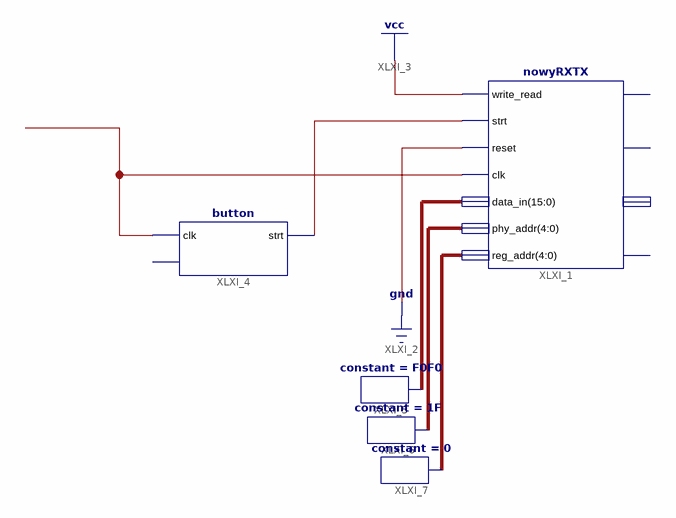
[diagram p0: schematic sheet 1]
// Xilinx ISE schematic nowy_sch.sch (spartan3e) as structural Verilog: 5 symbols, 0 ports
module nowy_sch (
);

  wire XLXN_2, XLXN_4;
  wire [4:0] XLXN_6, XLXN_7;
  wire [15:0] XLXN_5;

  nowyRXTX XLXI_1 (
    .write_read(1'b1), .strt(XLXN_2), .reset(1'b0), .clk(XLXN_4), .data_in(XLXN_5), .phy_addr(XLXN_6),
    .reg_addr(XLXN_7));  // open: busy, MDC, data_out, MDIO
  button XLXI_4 (.clk(XLXN_4), .strt(XLXN_2));  // open: btn
  constant #(.CValue("F0F0")) XLXI_5 (.O(XLXN_5));
  constant #(.CValue("1F")) XLXI_6 (.O(XLXN_6));
  constant #(.CValue("0")) XLXI_7 (.O(XLXN_7));
endmodule
